# EAGLE design Beacon (EAGLE 9.4.2)
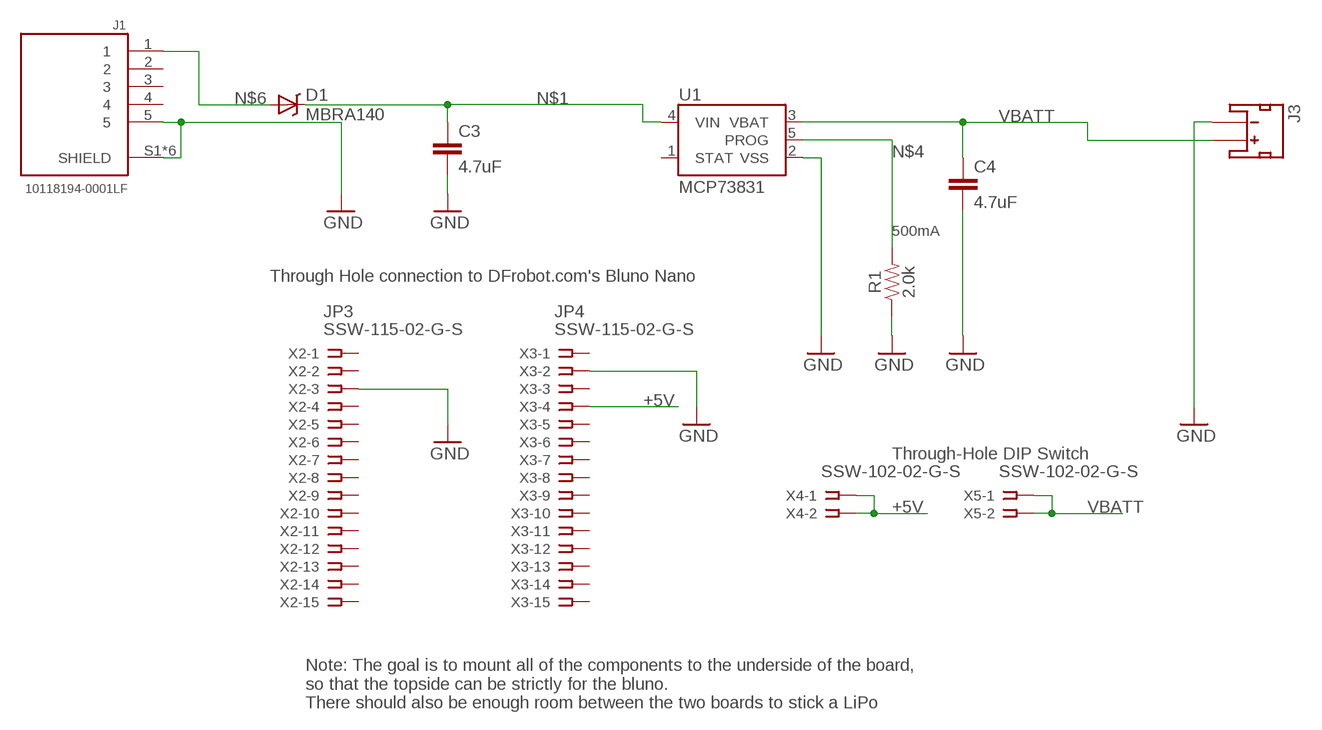
[diagram p0: schematic, sheet 1]

## Parts
C3  4.7uF  4.7UF0603  [0603]
C4  4.7uF  4.7UF0603  [0603]
D1  MBRA140  [SMA-DIODE]
J1  10118194-0001LF  [AMPHENOL_10118194-0001LF]
J3  JST_2MM_MALE  [JST-2-SMD]
R1  2.0k  2.0KOHM-0603-1/10W-5%  [0603]
U1  MCP73831  [SOT23-5]
X2  SSW-115-02-G-S  [SSW-115-02-G-S]
X3  SSW-115-02-G-S  [SSW-115-02-G-S]
X4  SSW-102-02-G-S  [SSW-102-02-G-S]
X5  SSW-102-02-G-S  [SSW-102-02-G-S]

## Nets
+5V: X3.4 X4.1 X4.2
GND: C3.2 C4.2 J1.5 J1.S1(SHIELD) J1.S2(SHIELD) J1.S3(SHIELD) J1.S4(SHIELD) J1.S5(SHIELD) J1.S6(SHIELD) J3.1(-) R1.1 U1.2(VSS) X2.3 X3.2
N$1: C3.1 D1.C U1.4(VIN)
N$4: R1.2 U1.5(PROG)
N$6: D1.A J1.1
VBATT: C4.1 J3.2(+) U1.3(VBAT) X5.1 X5.2
Unconnected: J1.2 J1.3 J1.4 J3.NC1(PAD1) J3.NC2(PAD2) U1.1(STAT) X2.1 X2.2 X2.4 X2.5 X2.6 X2.7 X2.8 X2.9 X2.10 X2.11 X2.12 X2.13 X2.14 X2.15 X3.1 X3.3 X3.5 X3.6 X3.7 X3.8 X3.9 X3.10 X3.11 X3.12 X3.13 X3.14 X3.15

## Notes on the sheet
- 500mA
- Through Hole connection to DFrobot.com's Bluno Nano
- JP3 | JP4
- Through-Hole DIP Switch
- Note: The goal is to mount all of the components to the underside of the board,
  so that the topside can be strictly for the bluno.
  There should also be enough room between the two boards to stick a LiPo

## Library data of the parts
C3 C4 = SparkFun-Capacitors:4.7UF: 4.7µF ceramic capacitors A capacitor is a passive two-terminal electrical component used to store electrical energy temporarily in an electric field.; PROD_ID: CAP-08280
D1 = SparkFun-DiscreteSemi:MBRA140: 40V, 1A Schottky rectifier SMA/DO-214AC package DIO-08053; PROD_ID: DIO-08053
J1 = 10118194-0001LF:10118194-0001LF: Micro Usb, 2.0 Type b, Rcpt, Smt; AVAILABILITY: Unavailable; DESCRIPTION: Micro Usb, 2.0 Type b, Rcpt, Smt; MF: Amphenol ICC; MP: 10118194-0001LF; PACKAGE: None; PRICE: None
J3 = SparkFun-Connectors:JST_2MM_MALE: Mates to single-cell LiPo batteries. CONN-08352; PROD_ID: CONN-08352
R1 = SparkFun-Resistors:2.0KOHM: 2kΩ resistor A resistor is a passive two-terminal electrical component that implements electrical resistance as a circuit element. Resistors act to reduce current flow, and, at the same time, act to lower voltage levels within circuits. - Wikipedia; PROD_ID: RES-08296
U1 = SparkFun-PowerIC:MCP73831: Miniature single cell, fully integrated Li-Ion, Li-polymer charge management controller http://ww1.microchip.com/downloads/en/DeviceDoc/21984a.pdf IC-09995; PROD_ID: IC-09995
X2 X3 = con-samtec:SSW-115-02-G-S: THROUGH-HOLE .025" SQ POST SOCKET Source: Samtec SSW.pdf; MF: Samtec Inc.; MPN: SSW-115-02-G-S; OC_FARNELL: unknown; OC_NEWARK: 11P9564
X4 X5 = con-samtec:SSW-102-02-G-S: THROUGH-HOLE .025" SQ POST SOCKET Source: Samtec SSW.pdf; MF: Samtec Inc.; MPN: SSW-102-02-G-S; OC_FARNELL: unknown; OC_NEWARK: 11P9351

## Board
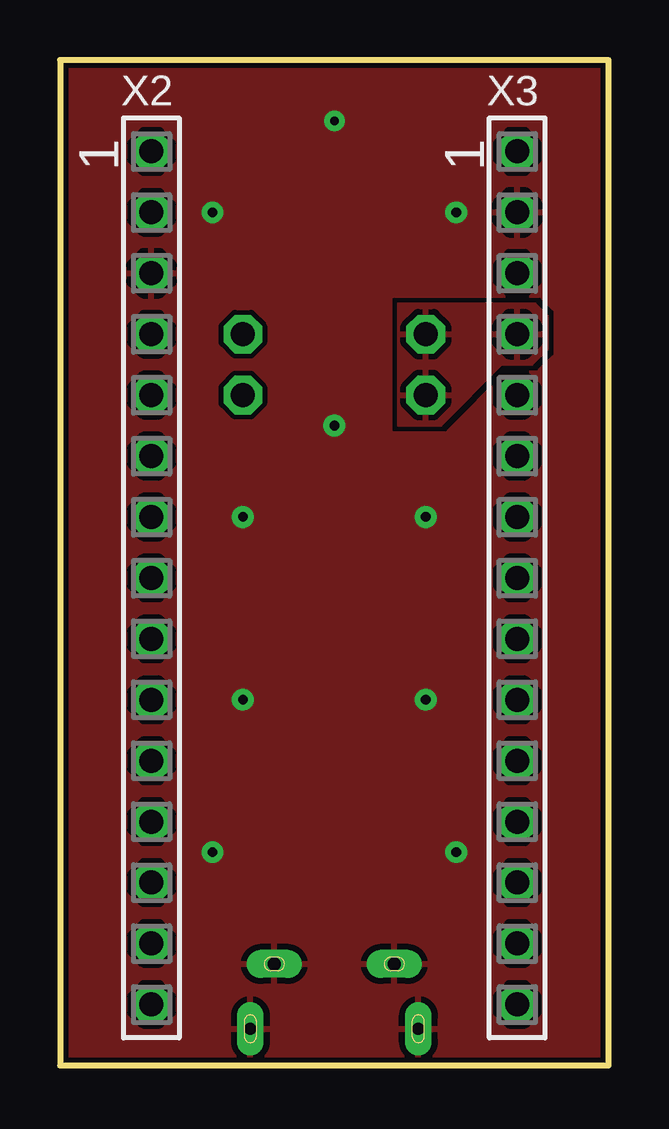
[diagram p1: board, top side]
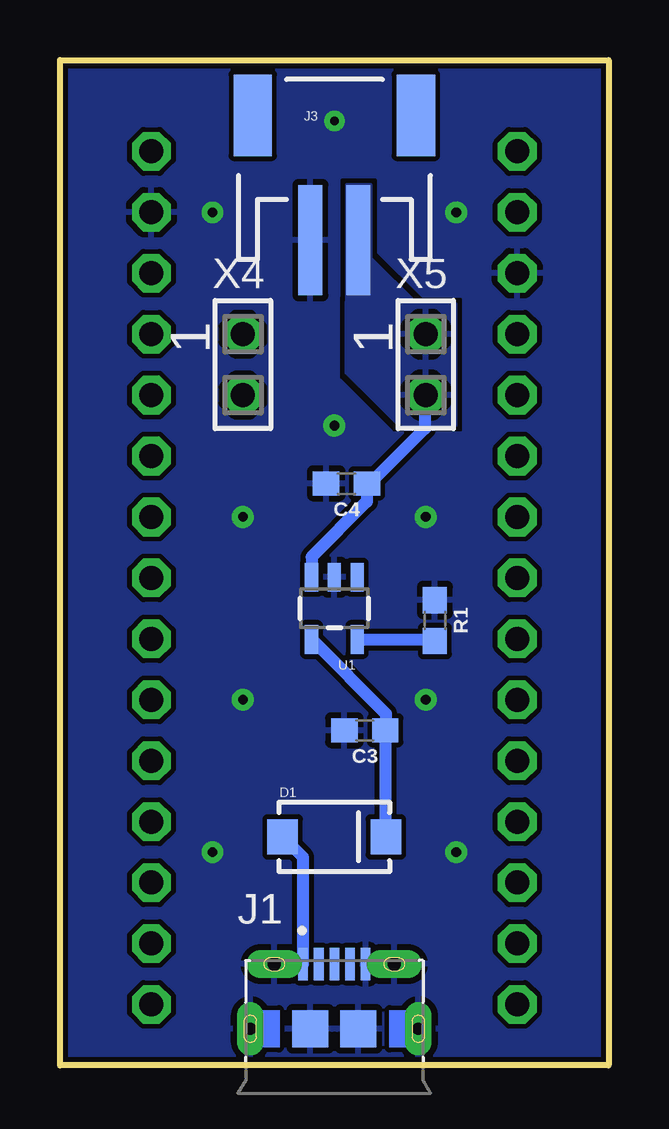
[diagram p2: board, bottom side, seen from below]

Size 22.86 x 41.91 mm. Coordinates in mm from the lower left corner, seen from the top.
Outline: 0,0 22.86,0 22.86,41.91 0,41.91 0,0
Copper layers (1*16): Top 0.035mm / dielectric 1.5mm / Bottom 0.035mm
Design rules "SparkFun *": minimum track width 8mil, minimum drill 20mil, track to track 8mil, track to pad 8mil, pad to pad 8mil, via to via 8mil, smd to smd 8mil, copper to edge 8mil, drill to drill 8mil, minimum pad ring 12mil, minimum via ring 10mil, stop-mask expansion 4mil, vias tented up to drill 20mil, thermal gap 10mil

### Footprints (pad centres in the part's own frame; a part is rotated, then mirrored left to right if it is on the bottom)
0603 = smd 1.1 x 1: 1 -0.85,0; 2 0.85,0
SMA-DIODE = smd 1.27 x 1.47: A -2.15,0; C 2.15,0
AMPHENOL_10118194-0001LF = smd 0.4 x 1.35: 1 -1.3,2.7; 2 -0.65,2.7; 3 0,2.7; 4 0.65,2.7; 5 1.3,2.7 | drill 0.55 pad 0.65 long: S1 -2.5,2.7; S2 2.5,2.7 | drill 0.5 pad 0.775 long: S3 -3.5,0; S6 3.5,0 | smd 1.5 x 1.55: S4 -1,0; S5 1,0
JST-2-SMD = smd 1 x 4.6: 1 -1,-3.7; 2 1,-3.7 | smd 1.6 x 3.4: NC1 -3.4,1.5; NC2 3.4,1.5
SOT23-5 = smd 0.55 x 1.2: 1 -0.95,-1.3; 2 0,-1.3; 3 0.95,-1.3; 4 0.95,1.3; 5 -0.95,1.3
SSW-115-02-G-S = drill 1 pad 1.5 octagon: 1 -17.78,0; 2 -15.24,0; 3 -12.7,0; 4 -10.16,0; 5 -7.62,0; 6 -5.08,0; 7 -2.54,0; 8 0,0; 9 2.54,0; 10 5.08,0; 11 7.62,0; 12 10.16,0; 13 12.7,0; 14 15.24,0; 15 17.78,0
SSW-102-02-G-S = drill 1 pad 1.5 octagon: 1 -1.27,0; 2 1.27,0

### Placement (x,y rotation side)
C3  10.16,13.97 180 bottom
C4  10.92,24.26 180 bottom
D1  11.43,9.53 0 bottom
J1  11.43,1.52 0 bottom
J3  11.43,38.1 0 bottom
R1  7.24,18.54 270 bottom
U1  11.43,19.05 180 bottom
X2  3.81,20.32 270 top
X3  19.05,20.32 270 top
X4  15.24,29.21 270 bottom
X5  7.62,29.21 270 bottom

### Tracks (layer width: path | path; a pad name or v marks a point on that pad's centre or on a via)
+5V
  pour Top: 14.1,31.75 14.1,26.67 15.88,26.67 18.41,29.21 19.68,29.21 20.32,29.84 20.32,31.24 19.81,31.75
GND  (via drill 0.35, 0.4)
  other vias: 6.35,35.56 16.51,35.56 11.43,26.67 7.62,22.86 15.24,22.86 7.62,15.24 15.24,15.24 6.35,8.89 16.51,8.89 11.43,39.37
  pour Bottom (rank 2): -1.27,43.18 24.13,43.18 24.13,-1.27 -1.27,-1.27
  pour Top (rank 2): -2.54,43.18 24.13,43.18 24.13,-1.27 -2.54,-1.27
N$1
  Bottom 0.508: D1.C 9.28,13.94 | 9.28,13.94 C3.1 9.31,14.14 | U1.4 9.28,14.65 9.28,13.94
N$4
  Bottom 0.508: U1.5 7.3,17.75 R1.2
N$6
  Bottom 0.508: J1.1 12.73,8.68 D1.A
VBATT
  Bottom 0.508: X5.2 7.66,27.9 7.66,26.54 9.95,24.26 C4.1 10.07,23.5 12.38,21.19 U1.3
  pour Bottom: 10.95,33.02 10.95,28.86 8.76,26.67 6.35,26.67 6.35,31.75 8.26,31.75 9.53,33.02
  pour Bottom (no thermals): 10.92,31.75 10.92,36.7 9.91,36.7 9.91,33.66 8,31.75